# Altium project FluidGuard(Rx).PrjPcb (part 1 of 3)
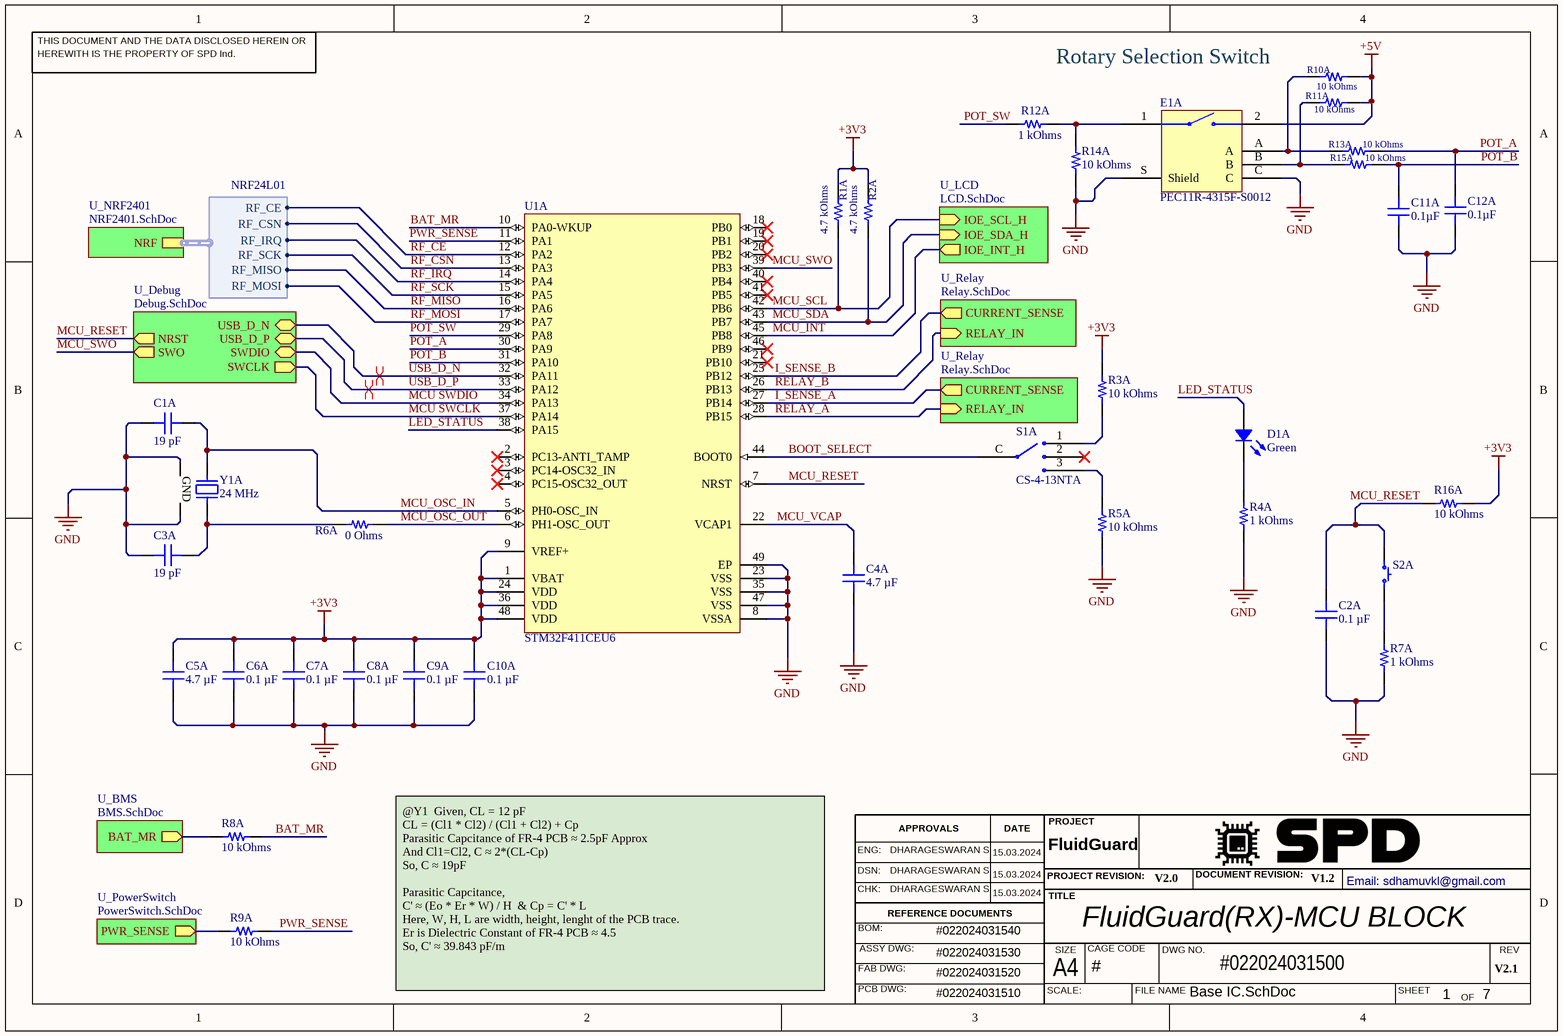
[diagram p0: Base IC.SchDoc]
CAGE_CODE: #; Date: 15.03.2024; DOC_NO_ASSY_DWG: #022024031530; DOC_NO_BOM: #022024031540; DOC_NO_FAB_DWG: #022024031520; DOC_NO_SCH_DWG: #022024031500; DocumentRevision: V1.2; PCB_DWG_NO: #022024031510; Project: FluidGuard; ProjectRevision: V2.0; Revision: V2.1
7 sheets, 151 parts. Net scope: hierarchical (ports join the sheet entries above them; power ports are global).
Board file: FluidGuard(RX).PcbDoc
Sheets:
  Base IC.SchDoc
    U_LCD = LCD.SchDoc
    U_Relay = Relay.SchDoc
    U_Relay = Relay.SchDoc
    U_PowerSwitch = PowerSwitch.SchDoc
    U_Debug = Debug.SchDoc
    U_BMS = BMS.SchDoc
    U_NRF2401 = NRF2401.SchDoc

## Sheet Base IC.SchDoc: FluidGuard(RX)-MCU BLOCK
size A4; SheetNumber: 1; SheetTotal: 7

### Parts
C1A  19 pF  [CAP 0402_1005]
C2A  0.1 µF  [CAP 0402_1005]
C3A  19 pF  [CAP 0402_1005]
C4A  4.7 µF  [CAP 0402_1005]
C5A  4.7 µF  [CAP 0402_1005]
C6A  0.1 µF  [CAP 0402_1005]
C7A  0.1 µF  [CAP 0402_1005]
C8A  0.1 µF  [CAP 0402_1005]
C9A  0.1 µF  [CAP 0402_1005]
C10A  0.1 µF  [CAP 0402_1005]
C11A  0.1µF  [CAP 0402_1005]
C12A  0.1µF  [CAP 0402_1005]
D1A  Green  [LED 0402_1005 GREEN]
E1A  PEC11R-4315F-S0012  [BOURNS PEC11R-4315F-S0012]
R1A  4.7 kOhms  [RES 0402_1005]
R2A  4.7 kOhms  [RES 0402_1005]
R3A  10 kOhms  [RES 0402_1005]
R4A  1 kOhms  [RES 0402_1005]
R5A  10 kOhms  [RES 0402_1005]
R6A  0 Ohms  [RES 0402_1005]
R7A  1 kOhms  [RES 0402_1005]
R8A  10 kOhms  [RES 0402_1005]
R9A  10 kOhms  [RES 0402_1005]
R10A  10 kOhms  [RES 0402_1005]
R11A  10 kOhms  [RES 0402_1005]
R12A  1 kOhms  [RES 0402_1005]
R13A  10 kOhms  [RES 0402_1005]
R14A  10 kOhms  [RES 0402_1005]
R15A  10 kOhms  [RES 0402_1005]
R16A  10 kOhms  [RES 0402_1005]
S1A  CS-4-13NTA  [NIDEC COPAL CS-4-13NTA]
S2A  EVP-AWED4A  [PANASONIC EVPAW]  (value not drawn)
U1A  STM32F411CEU6  [STM-UFQFPN48_L]
Y1A  24 MHz  [EPSON TSX-3225]

### Sub-sheets
U_BMS = BMS.SchDoc: BAT_MR (out)
U_Debug = Debug.SchDoc: USB_D_N (bidir), USB_D_P (bidir), SWDIO (bidir), SWCLK (out), NRST (out), SWO (out)
U_LCD = LCD.SchDoc: IOE_SCL_H (in), IOE_SDA_H (in), IOE_INT_H (out)
U_NRF2401 = NRF2401.SchDoc: NRF (harness NRF24L01)
U_PowerSwitch = PowerSwitch.SchDoc: PWR_SENSE (out)
U_Relay = Relay.SchDoc: CURRENT_SENSE (out), RELAY_IN (in)
U_Relay = Relay.SchDoc: CURRENT_SENSE (out), RELAY_IN (in)

### Harnesses
NRF24L01: RF_CE, RF_CSN, RF_SCK, RF_MISO, RF_MOSI, RF_IRQ

### Nets
+3V3: C5A.2 C6A.2 C7A.2 C8A.2 C9A.2 C10A.2 R1A.2 R2A.2 R3A.2 R16A.1 U1A.1(VBAT) U1A.9(VREF+) U1A.24(VDD) U1A.36(VDD) U1A.48(VDD)
+5V: E1A.2 R10A.2 R11A.2
GND: C1A.1 C2A.1 C3A.1 C4A.1 C5A.1 C6A.1 C7A.1 C8A.1 C9A.1 C10A.1 C11A.1 C12A.1 E1A.C E1A.S(Shield) R4A.1 R5A.1 R7A.1 R14A.1 U1A.8(VSSA) U1A.23(VSS) U1A.35(VSS) U1A.47(VSS) U1A.49(EP) Y1A.2(GND) Y1A.4(GND)
BAT_MR: R8A.1 U1A.10(PA0-WKUP)
BOOT_SELECT: S1A.C U1A.44(BOOT0)
I_SENSE_A: U1A.27(PB14) ; sheet U_Relay/CURRENT_SENSE
I_SENSE_B: U1A.25(PB12) ; sheet U_Relay/CURRENT_SENSE
LED_STATUS: D1A.1 U1A.38(PA15)
MCU SWCLK: U1A.37(PA14) ; sheet U_Debug/SWCLK
MCU SWDIO: U1A.34(PA13) ; sheet U_Debug/SWDIO
MCU_INT: U1A.45(PB8) ; sheet U_LCD/IOE_INT_H
MCU_OSC_IN: C1A.2 U1A.5(PH0-OSC_IN) Y1A.1
MCU_OSC_OUT: R6A.2 U1A.6(PH1-OSC_OUT)
MCU_RESET: C2A.2 R16A.2 S2A.1 U1A.7(NRST) ; sheet U_Debug/NRST
MCU_SCL: R1A.1 U1A.42(PB6) ; sheet U_LCD/IOE_SCL_H
MCU_SDA: R2A.1 U1A.43(PB7) ; sheet U_LCD/IOE_SDA_H
MCU_SWO: U1A.39(PB3) ; sheet U_Debug/SWO  [project net MCU SWO]
MCU_VCAP: C4A.2 U1A.22(VCAP1)
POT_A: C12A.2 R13A.1 U1A.30(PA9)
POT_B: C11A.2 R15A.1 U1A.31(PA10)
POT_SW: R12A.2 U1A.29(PA8)
PWR_SENSE: R9A.1 U1A.11(PA1)
RELAY_A: U1A.28(PB15) ; sheet U_Relay/RELAY_IN
RELAY_B: U1A.26(PB13) ; sheet U_Relay/RELAY_IN
RF_CE: U1A.12(PA2) ; sheet U_NRF2401/NRF.RF_CE
RF_CSN: U1A.13(PA3) ; sheet U_NRF2401/NRF.RF_CSN
RF_IRQ: U1A.14(PA4) ; sheet U_NRF2401/NRF.RF_IRQ
RF_MISO: U1A.16(PA6) ; sheet U_NRF2401/NRF.RF_MISO
RF_MOSI: U1A.17(PA7) ; sheet U_NRF2401/NRF.RF_MOSI
RF_SCK: U1A.15(PA5) ; sheet U_NRF2401/NRF.RF_SCK
USB_D_N: U1A.32(PA11) ; sheet U_Debug/USB_D_N  [project net TVS_D_N]
USB_D_P: U1A.33(PA12) ; sheet U_Debug/USB_D_P  [project net TVS_D_P]
NetC3A_2: C3A.2 R6A.1 Y1A.3
NetD1A_2: D1A.2 R4A.2
NetE1A_1: E1A.1 R12A.1 R14A.2
NetE1A_A: E1A.A R10A.1 R13A.2
NetE1A_B: E1A.B R11A.1 R15A.2
NetIC1E_4: R9A.2 ; sheet U_PowerSwitch/PWR_SENSE
NetR3A_1: R3A.1 S1A.1
NetR5A_2: R5A.2 S1A.3
NetR6D_1: R8A.2 ; sheet U_BMS/BAT_MR
NetR7A_2: R7A.2 S2A.2

Not connected (* = marked no-connect by the designer): S1A 2*; U1A 2(PC13-ANTI_TAMP)* 3(PC14-OSC32_IN)* 4(PC15-OSC32_OUT)* 18(PB0)* 19(PB1)* 20(PB2)* 21(PB10)* 40(PB4)* 41(PB5)* 46(PB9)*

### Layout directives
differential pair: TVS_D_N, TVS_D_P

### Notes on the sheet
- (near R10A) Rotary Selection Switch
- @Y1  Given, CL = 12 pF
  CL = (Cl1 * Cl2) / (Cl1 + Cl2) + Cp
  Parasitic Capcitance of FR-4 PCB ≈ 2.5pF Approx
  And Cl1=Cl2, C ≈ 2*(CL-Cp)
  So, C ≈ 19pF
  Parasitic Capcitance,
  C' ≈ (Eo * Er * W) / H  & Cp = C' * L
  Here, W, H, L are width, height, lenght of the PCB trace.
  Er is Dielectric Constant of FR-4 PCB ≈ 4.5
  So, C' ≈ 39.843 pF/m
- THIS DOCUMENT AND THE DATA DISCLOSED HEREIN OR
- HEREWITH IS THE PROPERTY OF SPD Ind.
- ENG:
- DHARAGESWARAN S
- APPROVALS
- DATE
- PROJECT
- DSN:
- CHK:
- REFERENCE DOCUMENTS
- PROJECT REVISION:
- TITLE
- DOCUMENT REVISION:
- Email: sdhamuvkl@gmail.com <https://github.com/DhamuVkl>
- BOM:
- FAB DWG:
- PCB DWG:
- ASSY DWG:
- SCALE:
- A4
- SIZE
- CAGE CODE
- FILE NAME
- DWG NO.
- SHEET
- REV
- OF

### Library data of the parts
C1A C3A = GJM1555C1H190GB01D: CAP CER 19PF 50VDC 0402 C0G 2%; Manufacturer: Murata Electronics; id: 5279; Temperature Coefficient: C0G, NP0; Voltage - Rated: 50V; Part Number: GJM1555C1H190GB01D; Value: 19 pF; Supplier Part Number 1: 490-GJM1555C1H190GB01DCT-ND; ComponentLink2Description: DigiKey Link; Features: High Q, Low Loss; ComponentLink1URL: https://search.murata.co.jp/Ceramy/image/img/A01X/G101/ENG/GJM1555C1H190GB01-01A.pdf; PartId: 41775; Tolerance: ±2%; Supplier 1: DigiKey; Series: GJM; LastUpdated: 2023-01-03T20:03:22.137; Part Status: Active; Capacitance: 19 pF; Device Package: 0402 (1005 Metric); Thickness (Max): 0.022" (0.55mm); Minimum Order: 1; Packaging: TapeAndReel; Applications: RF, Microwave, High Frequency; Package / Case: 0402 (1005 Metric); ComponentLink1Description: Datasheet; Price: 0.02; ComponentLink2URL: https://www.digikey.com/en/products/detail/murata-electronics/GJM1555C1H190GB01D/16033843; Lifecycle Status: Active; Operating Temperature: -55°C ~ 125°C; Size / Dimension: 0.039" L x 0.020" W (1.00mm x 0.50mm); Mounting Type: Surface Mount, MLCC
C2A C6A C7A C8A C9A C10A = CL05B104KP5VPNC: CAP CER 100NF 10V X7R 0402; Manufacturer: Samsung Electro-Mechanics; id: 7736; Tolerance: ±10%; Part Number: CL05B104KP5VPNC; Value: 0.1 µF; Temperature Coefficient: X7R; Supplier Part Number 1: 1276-CL05B104KP5VPNCCT-ND; ComponentLink2Description: DigiKey Link; ComponentLink1URL: https://mm.digikey.com/Volume0/opasdata/d220001/medias/docus/5458/CL05B104KP5VPNC_Spec.pdf; PartId: 56690; Supplier 1: DigiKey; Series: CL; LastUpdated: 2023-11-05T20:02:55.743; Capacitance: 0.1 µF; Device Package: 0402 (1005 Metric); Ratings: AEC-Q200; Thickness (Max): 0.022" (0.55mm); Voltage - Rated: 10V; Minimum Order: 1; Packaging: TapeAndReel; Applications: Automotive; Package / Case: 0402 (1005 Metric); ComponentLink1Description: Datasheet; Price: 0.01; ComponentLink2URL: https://www.digikey.com/en/products/detail/samsung-electro-mechanics/CL05B104KP5VPNC/20498482; Lifecycle Status: Active; Operating Temperature: -55°C ~ 125°C; Size / Dimension: 0.039" L x 0.020" W (1.00mm x 0.50mm); Mounting Type: Surface Mount, MLCC
C4A C5A = GMC04X5R475K10NT: CAP0402 X5R 4.7UF 10% 10V; Manufacturer: Cal-Chip Electronics, Inc.; id: 6422; Part Number: GMC04X5R475K10NT; Value: 4.7 µF; Temperature Coefficient: X5R; Supplier Part Number 1: 4713-GMC04X5R475K10NTCT-ND; ComponentLink2Description: DigiKey Link; ComponentLink1URL: https://88ce57.p3cdn1.secureserver.net/wp-content/uploads/2023/01/gmc_series-2.pdf; PartId: 49814; Tolerance: ±10%; Supplier 1: DigiKey; Series: GMC; LastUpdated: 2023-04-21T19:03:30.743; Part Status: Active; Capacitance: 4.7 µF; Device Package: 0402 (1005 Metric); Thickness (Max): 0.028" (0.70mm); Voltage - Rated: 10V; Minimum Order: 1; Packaging: TapeAndReel; Applications: General Purpose; Package / Case: 0402 (1005 Metric); ComponentLink1Description: Datasheet; Price: 0.01; ComponentLink2URL: https://www.digikey.com/en/products/detail/cal-chip-electronics-inc/GMC04X5R475K10NT/18151135; Lifecycle Status: Active; Operating Temperature: -55°C ~ 85°C; Size / Dimension: 0.039" L x 0.020" W (1.00mm x 0.50mm); Mounting Type: Surface Mount, MLCC
C11A C12A = LD02ZD104KAB2A: CAP CER 0.1UF 10V X5R 0402; Manufacturer: AVX Corporation; id: 74; Tolerance: ±10%; Part Number: LD02ZD104KAB2A; Value: 0.1µF; Temperature Coefficient: X5R; Supplier Part Number 1: 478-4926-1-ND; ComponentLink2Description: DigiKey Link; ComponentLink1URL: http://datasheets.avx.com/LD-Series.pdf; PartId: 1811; Supplier 1: DigiKey; Series: LD; LastUpdated: 2022-02-08T12:26:58.257; Part Status: Active; Capacitance: 0.1µF; Device Package: 0402 (1005 Metric); Thickness (Max): 0.022" (0.56mm); Voltage - Rated: 10V; Minimum Order: 1; Packaging: TapeAndReel; Applications: General Purpose; Package / Case: 0402 (1005 Metric); ComponentLink1Description: Datasheet; Price: 0.20; ComponentLink2URL: http://digikey.com/product-detail/en/avx-corporation/LD02ZD104KAB2A/478-4926-1-ND/1858872; Lifecycle Status: Active; Operating Temperature: -55°C ~ 85°C; Size / Dimension: 0.039" L x 0.020" W (1.00mm x 0.50mm); Mounting Type: Surface Mount, MLCC
D1A = HSMG-C280: LED GREEN DIFFUSED 0402 SMD; Manufacturer: Broadcom Limited; id: 697; Lens Color: White; Wavelength - Peak: 570nm; Lens Style: Rectangle with Flat Top; Viewing Angle: 130°; Lens Size: 1.00mm x 0.50mm; Configuration: Standard; Wavelength - Dominant: 572nm; Voltage - Forward (Vf) (Typ): 2.2V; Current - Test: 20mA; Millicandela Rating: 15mcd; Part Number: HSMG-C280; Supplier Part Number 1: 516-3066-1-ND; Lens Transparency: Diffused; Supplier Device Package: 0402; ComponentLink1Description: Datasheet; Color: Green; ComponentLink2URL: https://www.digikey.com/en/products/detail/broadcom-limited/HSMG-C280/1235358; ComponentLink1URL: https://docs.broadcom.com/docs/AV02-0602EN; Supplier 1: DigiKey; Series: -; Height (Max): 0.40mm; Part Status: Active; ComponentLink2Description: DigiKey Link; Device Package: 0402 (1005 Metric); Packaging: TapeAndReel; Minimum Order: 1; Package / Case: 0402 (1005 Metric); PartId: 697; Lifecycle Status: Active; LastUpdated: 2023-01-02T20:56:26.750; Value: Green; Size / Dimension: 1.00mm L x 0.50mm W; Mounting Type: Surface Mount; Price: 0.08
E1A = PEC11R-4315F-S0012: ROTARY ENCODER MECHANICAL 12PPR; Manufacturer 1: Bourns; Manufacturer: Bourns Inc.; Output Type: Quadrature (Incremental); Built in Switch: Yes; Number of Channels: 2; Pulses per Revolution: 12; Capacitance: 4315F; id: 3; Actuator Type: 6mm Dia Flatted End; Rotational Life (Cycles Min): 30K; Supplier 1: DigiKey; Manufacturer Part Number 1: PEC11R-4315F-S0012; Stock 1: 453; Pricing 1: 1=1.91000, 10=1.68200, 25=1.50800, 50=1.45000, 100=1.39200, 250=1.33400, 500=1.10200, 1000=1.04400, 5000=0.87000 (USD); RoHS: Yes; Mount: Through Hole,Panel,PCB; Min Operating Temperature: -30°C; Max Operating Temperature: 70°C; Termination: PC Pin; Packaging: Unknown; Package Quantity: 75; Encoder Type: Mechanical; Detent: Yes; Orientation: Vertical; Length: 21.5mm; Height: 13.4mm; Width: 12.5mm; ComponentLink1URL: https://www.bourns.com/docs/Product-Datasheets/PEC11R.pdf; ComponentLink1Description: Datasheet; ComponentLink2URL: http://digikey.com/product-detail/en/bourns-inc/PEC11R-4315F-S0012/PEC11R-4315F-S0012-ND/4699232; ComponentLink2Description: DigiKey Link; Part Number: PEC11R-4315F-S0012; Supplier Part Number 1: PEC11R-4315F-S0012-ND; Series: PEC11R; Part Status: Active; Minimum Order: 1; Lifecycle Status: Active; LastUpdated: 2020-06-25T15:43:11.617; Termination Style: PC Pin; Mounting Type: Panel, PCB Through Hole; Price: 1.91
R1A R2A = AC0402FR-074K7L: RES SMD 4.7K OHM 1% 1/16W 0402; Manufacturer: Yageo; id: 4996; Temperature Coefficient: ±100ppm/°C; Power (Watts): 0.063W, 1/16W; Part Number: AC0402FR-074K7L; Height - Seated (Max): 0.015" (0.37mm); Supplier Part Number 1: YAG3497CT-ND; Supplier Device Package: 0402; ComponentLink1Description: Datasheet; ComponentLink2URL: https://www.digikey.com/en/products/detail/yageo/AC0402FR-074K7L/5895396; Features: Automotive AEC-Q200, Moisture Resistant; ComponentLink1URL: https://www.yageo.com/upload/media/product/productsearch/datasheet/rchip/PYu-AC_51_RoHS_L_7.pdf; Composition: Thick Film; Tolerance: ±1%; Supplier 1: DigiKey; Series: AC; Part Status: Active; ComponentLink2Description: DigiKey Link; Device Package: 0402 (1005 Metric); Packaging: CutTape; Ratings: AEC-Q200; Minimum Order: 1; Package / Case: 0402 (1005 Metric); PartId: 12051; Lifecycle Status: Active; LastUpdated: 2023-01-02T20:21:09.847; Operating Temperature: -55°C ~ 155°C; Number Of Terminations: 2; Value: 4.7 kOhms; Size / Dimension: 0.039" L x 0.020" W (1.00mm x 0.50mm); Price: 0.01; Resistance: 4.7 kOhms
R3A R5A R8A R9A R10A R11A R13A R14A R15A R16A = AA0402FR-0710KL: RES SMD 10K OHM 1% 1/16W 0402; Manufacturer: Yageo; id: 10610; Temperature Coefficient: ±150ppm/°C; Power (Watts): 0.063W, 1/16W; Part Number: AA0402FR-0710KL; Height - Seated (Max): 0.015" (0.37mm); Supplier Part Number 1: 13-AA0402FR-0710KLCT-ND; Supplier Device Package: 0402; ComponentLink1Description: Datasheet; ComponentLink2URL: https://www.digikey.com/en/products/detail/yageo/AA0402FR-0710KL/5887729; Features: Anti-Sulfur, Automotive AEC-Q200, Moisture Resistant; ComponentLink1URL: https://www.yageo.com/upload/media/product/productsearch/datasheet/rchip/PYu-AA_51_RoHS_L_3.pdf; Composition: Thick Film; Tolerance: ±1%; Supplier 1: DigiKey; Series: AA; Part Status: Active; ComponentLink2Description: DigiKey Link; Device Package: 0402 (1005 Metric); Packaging: TapeAndReel; Ratings: AEC-Q200; Minimum Order: 1; Package / Case: 0402 (1005 Metric); PartId: 59190; Lifecycle Status: Active; LastUpdated: 2023-01-02T20:20:10.303; Operating Temperature: -55°C ~ 155°C; Number Of Terminations: 2; Value: 10 kOhms; Size / Dimension: 0.039" L x 0.020" W (1.00mm x 0.50mm); Price: 0.01; Resistance: 10 kOhms
R4A R7A R12A = AA0402FR-071KL: RES SMD 1K OHM 1% 1/16W 0402; Manufacturer: Yageo; id: 10598; Temperature Coefficient: ±150ppm/°C; Power (Watts): 0.063W, 1/16W; Part Number: AA0402FR-071KL; Height - Seated (Max): 0.015" (0.37mm); Supplier Part Number 1: 13-AA0402FR-071KLCT-ND; Supplier Device Package: 0402; ComponentLink1Description: Datasheet; ComponentLink2URL: https://www.digikey.com/en/products/detail/yageo/AA0402FR-071KL/5887878; Features: Anti-Sulfur, Automotive AEC-Q200, Moisture Resistant; ComponentLink1URL: https://www.yageo.com/upload/media/product/productsearch/datasheet/rchip/PYu-AA_51_RoHS_L_3.pdf; Composition: Thick Film; Tolerance: ±1%; Supplier 1: DigiKey; Series: AA; Part Status: Active; ComponentLink2Description: DigiKey Link; Device Package: 0402 (1005 Metric); Packaging: TapeAndReel; Ratings: AEC-Q200; Minimum Order: 1; Package / Case: 0402 (1005 Metric); PartId: 59178; Lifecycle Status: Active; LastUpdated: 2023-01-02T20:20:10.210; Operating Temperature: -55°C ~ 155°C; Number Of Terminations: 2; Value: 1 kOhms; Size / Dimension: 0.039" L x 0.020" W (1.00mm x 0.50mm); Price: 0.01; Resistance: 1 kOhms
R6A = AC0402JR-070RL: RES SMD 0 OHM JUMPER 1/16W 0402; Manufacturer: Yageo; id: 9339; Power (Watts): 0.063W, 1/16W; Part Number: AC0402JR-070RL; Height - Seated (Max): 0.015" (0.37mm); Supplier Part Number 1: 311-0.0LBCT-ND; Supplier Device Package: 0402; ComponentLink1Description: Datasheet; ComponentLink2URL: https://www.digikey.com/en/products/detail/yageo/AC0402JR-070RL/2827807; Features: Automotive AEC-Q200, Moisture Resistant; ComponentLink1URL: https://www.yageo.com/upload/media/product/productsearch/datasheet/rchip/PYu-AC_51_RoHS_L_7.pdf; Composition: Thick Film; Tolerance: Jumper; Supplier 1: DigiKey; Series: AC; Part Status: Active; ComponentLink2Description: DigiKey Link; Device Package: 0402 (1005 Metric); Packaging: CutTape; Ratings: AEC-Q200; Minimum Order: 1; Package / Case: 0402 (1005 Metric); PartId: 20617; Lifecycle Status: Active; LastUpdated: 2023-01-02T20:20:32.243; Operating Temperature: -55°C ~ 155°C; Number Of Terminations: 2; Value: 0 Ohms; Size / Dimension: 0.039" L x 0.020" W (1.00mm x 0.50mm); Price: 0.01; Resistance: 0 Ohms
S1A = CS-4-13NTA: SWITCH ROTARY DIP SP3T 100MA 16V; Manufacturer: Nidec Copal Electronics; id: 6; Actuator Level: Flush, Recessed; Number Of Positions: 3; Washable: Yes; Pitch: 0.051" (1.30mm); Actuator Type: Rotary for Tool; Part Number: CS-4-13NTA; Height Above Board: 0.091" (2.30mm); Supplier Part Number 1: 563-1035-1-ND; Current Rating (Amps): 100mA; ComponentLink1Description: Datasheet; Contact Material: Copper Alloy; ComponentLink2URL: https://www.digikey.com/en/products/detail/nidec-copal-electronics/CS-4-13NTA/948346; ComponentLink1URL: https://www.nidec-copal-electronics.com/e/catalog/switch/cs-4.pdf; Supplier 1: DigiKey; Series: CS-4; Part Status: Active; ComponentLink2Description: DigiKey Link; Packaging: TapeAndReel; Minimum Order: 1; Contact Finish: Gold; PartId: 13; Lifecycle Status: Active; LastUpdated: 2022-09-26T03:19:43.077; Termination Style: J Lead; Operating Temperature: -25°C ~ 70°C; Circuit: SP3T; Mounting Type: Surface Mount; Price: 0.93
S2A = EVP-AWED4A: 3.0MM X 2.0MM / 3.3N / 0.15MM ST; Manufacturer: Panasonic Electronic Components; id: 5; Switch Function: Off-Mom; Contact Rating @ Voltage: 0.02A @ 15VDC; Outline: 3.00mm x 2.00mm; Actuator Height Off Pcb, Vertical: 0.60mm; Ingress Protection: IP67 - Dust Tight, Waterproof; Actuator Orientation: Top Actuated; Actuator Type: Standard; Illumination: Non-Illuminated; Operating Force: 330gf; Circuit: SPST-NO; Part Number: EVP-AWED4A; Supplier Part Number 1: P123440CT-ND; ComponentLink1Description: Datasheet; ComponentLink2URL: https://www.digikey.com/en/products/detail/panasonic-electronic-components/EVP-AWED4A/8568275; ComponentLink1URL: https://industrial.panasonic.com/ac/cdn/e/control/switch/light-touch/catalog/sw_lt_eng_3020s.pdf; Supplier 1: DigiKey; Series: EVPAW; Part Status: Active; ComponentLink2Description: DigiKey Link; Packaging: TapeAndReel; Minimum Order: 1; Lifecycle Status: Active; LastUpdated: 2023-01-02T21:07:29.980; Termination Style: SMD (SMT) Tab; Operating Temperature: -40°C ~ 85°C; Mounting Type: Surface Mount; Price: 0.16
U1A = CMP-0243-00165-1: ARM Cortex-M4 32-bit MCU+FPU, 512 KB Flash, 128 KB RAM, 36 I/Os, 48-Pin UFQFPN, -40 to 85 degC, Tray; Operating Frequency(F) (Processor speed) (MHz): 100; FLASH Size (Prog) (kB): 512; Internal RAM Size (kB): 128; I/Os (High Current): 36; Supply Voltage(Vcc) min (V): 1.7; Package Reference: 48-Pin Ultra Thin Fine Pitch Quad Flat No-Lead, 7 x 7 x 0.6 mm Body, 0.5 mm Pitch, Exposed Pad; ComponentLink1Description: Manufacturer URL; ComponentLink1URL: http://www.st.com/; Packing: Tray; Package Description: UFQFPN48; Core: ARM Cortex-M4; ComponentLink2Description: Datasheet; ComponentLink2URL: http://www.st.com/st-web-ui/static/active/en/resource/technical/document/datasheet/DM00115249.pdf; DatasheetVersion: Rev. 6; Mounting Technology: Surface Mount
Y1A = TSX-3225 24.0000MF15X-AC3: CRYSTAL 24.0000MHZ 9PF SMD; Manufacturer: EPSON; id: 441; Frequency Tolerance: ±10ppm; Frequency Stability: ±15ppm; Operating Mode: Fundamental; Esr (Equivalent Series Resistance): 40 Ohms; Part Number: TSX-3225 24.0000MF15X-AC3; Height - Seated (Max): 0.024" (0.60mm); Supplier Part Number 1: SER3635CT-ND; ComponentLink1Description: Datasheet; ComponentLink2URL: https://www.digikey.com/en/products/detail/epson/TSX-3225-24-0000MF15X-AC3/1825444; ComponentLink1URL: https://support.epson.biz/td/api/doc_check.php?dl=brief_TSX-3225&lang=en; Supplier 1: DigiKey; Frequency: 24 MHz; Series: TSX-3225; Part Status: Active; Type: MHz Crystal; ComponentLink2Description: DigiKey Link; Packaging: TapeAndReel; Minimum Order: 1; Package / Case: 4-SMD, No Lead; PartId: 441; Lifecycle Status: Active; LastUpdated: 2023-01-02T20:58:19.840; Operating Temperature: -40°C ~ 85°C; Value: 24 MHz; Size / Dimension: 0.126" L x 0.098" W (3.20mm x 2.50mm); Mounting Type: Surface Mount; Price: 0.44; Load Capacitance: 9pF

## Sheet LCD.SchDoc: LCD I2C BLOCK
size A4; SheetNumber: 3; SheetTotal: 7; DOC_NO_SCH_DWG: #022024031502
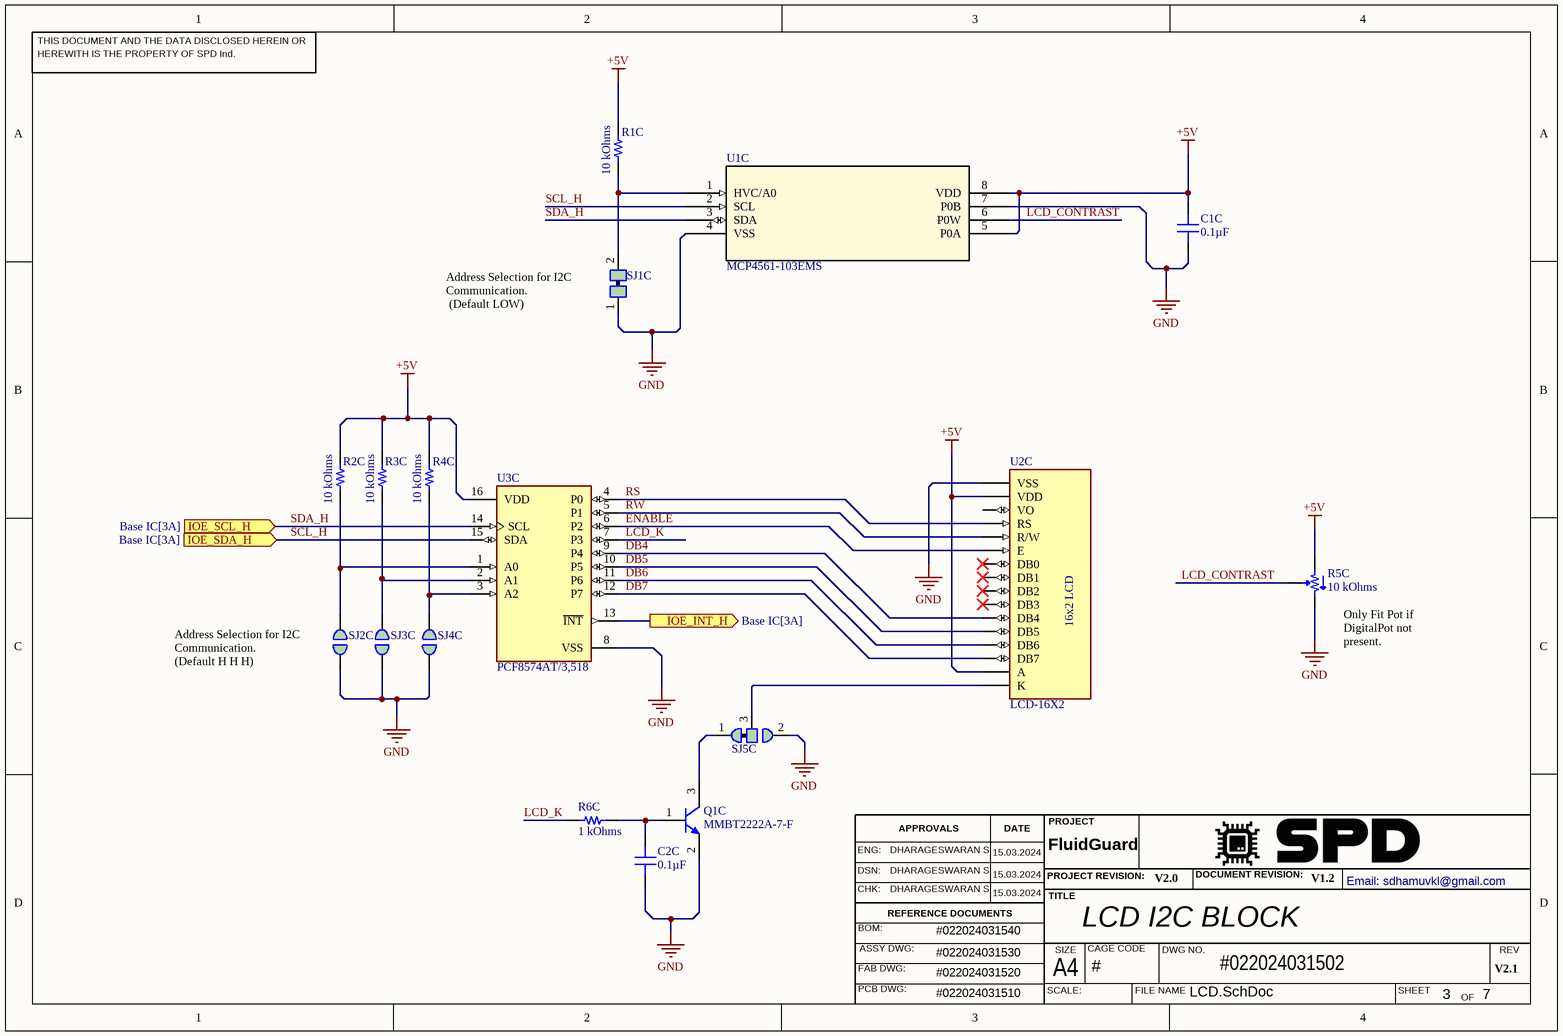
[diagram p1: LCD.SchDoc]

### Parts
C1C  0.1µF  [CAP 0402_1005]
C2C  0.1µF  [CAP 0402_1005]
Q1C  MMBT2222A-7-F  [DIODES SOT-23-3]
R1C  10 kOhms  [RES 0402_1005]
R2C  10 kOhms  [RES 0402_1005]
R3C  10 kOhms  [RES 0402_1005]
R4C  10 kOhms  [RES 0402_1005]
R5C  10 kOhms  [BOURNS TRIMPOT 3299P]
R6C  1 kOhms  [RES 0402_1005]
SJ1C  2PIN  [Rectangular Jumper Joint]  (value not drawn)
SJ2C  2PIN  [Rounded Jumper]  (value not drawn)
SJ3C  2PIN  [Rounded Jumper]  (value not drawn)
SJ4C  2PIN  [Rounded Jumper]  (value not drawn)
SJ5C  3PIN  [Rounded Jumper Joint 3-pin]  (value not drawn)
U1C  MCP4561-103EMS  [MSOP8_MC_MCH]
U2C  LCD-16X2  [LCD-16X2 Pin]
U3C  PCF8574AT/3,518  [FP-SOT162-1-MFG]

### Ports
IOE_INT_H (out, see Base IC[3A]), IOE_SCL_H (in, see Base IC[3A]), IOE_SDA_H (in, see Base IC[3A])

### Nets
+5V: C1C.2 R1C.2 R2C.2 R3C.2 R4C.2 R5C.1 U1C.5(P0A) U1C.8(VDD) U2C.2(VDD) U2C.15(A) U3C.16(VDD)
GND: C1C.1 C2C.1 Q1C.2(E) R5C.3 SJ1C.1 SJ2C.1 SJ3C.1 SJ4C.1 SJ5C.2 U1C.4(VSS) U1C.7(P0B) U2C.1(VSS) U3C.8(VSS)
DB4: U2C.11(DB4) U3C.9(P4)
DB5: U2C.12(DB5) U3C.10(P5)
DB6: U2C.13(DB6) U3C.11(P6)
DB7: U2C.14(DB7) U3C.12(P7)
ENABLE: U2C.6(E) U3C.6(P2)
LCD_CONTRAST: R5C.2 U1C.6(P0W)
LCD_K: R6C.1 U3C.7(P3)
MCU_INT: U3C.13(~{INT}) ; port IOE_INT_H
RS: U2C.4(RS) U3C.4(P0)
RW: U2C.5(R/W) U3C.5(P1)
SCL_H: U1C.2(SCL) U3C.15(SDA) ; port IOE_SDA_H  [project net MCU_SDA]
SDA_H: U1C.3(SDA) U3C.14(SCL) ; port IOE_SCL_H  [project net MCU_SCL]
NetC2C_2: C2C.2 Q1C.1(B) R6C.2
NetQ1C_3: Q1C.3(C) SJ5C.1
NetR1C_1: R1C.1 SJ1C.2 U1C.1(HVC/A0)
NetR2C_1: R2C.1 SJ2C.2 U3C.1(A0)
NetR3C_1: R3C.1 SJ3C.2 U3C.2(A1)
NetR4C_1: R4C.1 SJ4C.2 U3C.3(A2)
NetSJ5C_3: SJ5C.3 U2C.16(K)

Not connected (* = marked no-connect by the designer): U2C 3(VO) 7(DB0)* 8(DB1)* 9(DB2)* 10(DB3)*

### Notes on the sheet
- (near SJ1C) Address Selection for I2C Communication.
  (Default LOW)
- (near SJ2C) Address Selection for I2C Communication.
  (Default H H H)
- (near R5C) Only Fit Pot if DigitalPot not present.
- THIS DOCUMENT AND THE DATA DISCLOSED HEREIN OR
- HEREWITH IS THE PROPERTY OF SPD Ind.
- ENG:
- DHARAGESWARAN S
- APPROVALS
- DATE
- PROJECT
- DSN:
- CHK:
- REFERENCE DOCUMENTS
- PROJECT REVISION:
- TITLE
- DOCUMENT REVISION:
- Email: sdhamuvkl@gmail.com <https://github.com/DhamuVkl>
- BOM:
- FAB DWG:
- PCB DWG:
- ASSY DWG:
- SCALE:
- A4
- SIZE
- CAGE CODE
- FILE NAME
- DWG NO.
- SHEET
- REV
- OF
- (in symbol LCD-16X2) 16x2 LCD

### Library data of the parts
C1C C2C = 0402YC104KAT2A: CAP CER 0.1UF 16V X7R 0402; Manufacturer: AVX Corporation; id: 643; Tolerance: ±10%; Part Number: 0402YC104KAT2A; Value: 0.1µF; Temperature Coefficient: X7R; Supplier Part Number 1: 478-7888-1-ND; ComponentLink2Description: DigiKey Link; ComponentLink1URL: http://datasheets.avx.com/X7RDielectric.pdf; PartId: 3104; Supplier 1: DigiKey; Series: -; LastUpdated: 2022-02-08T12:26:55.697; Part Status: Active; Capacitance: 0.1µF; Device Package: 0402 (1005 Metric); Thickness (Max): 0.022" (0.55mm); Voltage - Rated: 16V; Minimum Order: 1; Packaging: TapeAndReel; Applications: General Purpose; Package / Case: 0402 (1005 Metric); ComponentLink1Description: Datasheet; Price: 0.01; ComponentLink2URL: http://digikey.com/product-detail/en/avx-corporation/0402YC104KAT2A/478-7888-1-ND/3881511; Lifecycle Status: Active; Operating Temperature: -55°C ~ 125°C; Size / Dimension: 0.039" L x 0.020" W (1.00mm x 0.50mm); Mounting Type: Surface Mount, MLCC
Q1C = MMBT2222A-7-F: TRANS NPN 40V 0.6A SOT23-3; Manufacturer: Diodes Incorporated; id: 84; Current - Collector (Ic) (Max): 600 mA; Power - Max: 310 mW; DC Current Gain (Hfe) (Min) @ Ic, Vce: 100 @ 150mA, 10V; Current - Collector Cutoff (Max): 10nA (ICBO); Vce Saturation (Max) @ Ib, Ic: 1V @ 50mA, 500mA; Frequency - Transition: 300MHz; Part Number: MMBT2222A-7-F; Supplier Part Number 1: MMBT2222A-FDICT-ND; Supplier Device Package: SOT-23-3; ComponentLink1Description: Datasheet; ComponentLink2URL: https://www.digikey.com/en/products/detail/diodes-incorporated/MMBT2222A-7-F/814503; ComponentLink1URL: https://www.diodes.com/assets/Datasheets/ds30041.pdf; Supplier 1: DigiKey; Series: Automotive, AEC-Q101; Part Status: Active; ComponentLink2Description: DigiKey Link; Packaging: TapeAndReel; Minimum Order: 1; Transistor Type: NPN; Voltage - Collector Emitter Breakdown (Max): 40 V; Package / Case: TO-236-3, SC-59, SOT-23-3; PartId: 84; Lifecycle Status: Active; LastUpdated: 2023-01-02T21:11:05.533; Operating Temperature: -55°C ~ 150°C (TJ); Mounting Type: Surface Mount; Price: 0.02
R1C R2C R3C R4C = AC0402FR-1310KL: RES 10K OHM 1% 1/16W 0402; Manufacturer: Yageo; id: 13132; Temperature Coefficient: ±100ppm/°C; Power (Watts): 0.063W, 1/16W; Part Number: AC0402FR-1310KL; Height - Seated (Max): 0.015" (0.37mm); Supplier Part Number 1: 13-AC0402FR-1310KLCT-ND; Supplier Device Package: 0402; ComponentLink1Description: Datasheet; ComponentLink2URL: https://www.digikey.com/en/products/detail/yageo/AC0402FR-1310KL/12756397; Features: Automotive AEC-Q200, Moisture Resistant; ComponentLink1URL: https://www.yageo.com/upload/media/product/productsearch/datasheet/rchip/PYu-AC_51_RoHS_L_8.pdf; Composition: Thick Film; Tolerance: ±1%; Supplier 1: DigiKey; Series: AC; Part Status: Active; ComponentLink2Description: DigiKey Link; Device Package: 0402 (1005 Metric); Packaging: CutTape; Ratings: AEC-Q200; Minimum Order: 1; Package / Case: 0402 (1005 Metric); PartId: 69220; Lifecycle Status: Active; LastUpdated: 2023-01-02T20:19:54.633; Operating Temperature: -55°C ~ 155°C; Number Of Terminations: 2; Value: 10 kOhms; Size / Dimension: 0.039" L x 0.020" W (1.00mm x 0.50mm); Price: 0.01; Resistance: 10 kOhms
R5C = 3299P-1-103LF: TRIMMER 10K OHM 0.5W PC PIN SIDE; Manufacturer: Bourns Inc.; id: 276; Temperature Coefficient: ±100ppm/°C; Resistive Material: Cermet; Tolerance: ±10%; Number Of Turns: 25; Adjustment Type: Side Adjustment; Power (Watts): 0.5W, 1/2W; Part Number: 3299P-1-103LF; Supplier Part Number 1: 3299P-103LF-ND; ComponentLink1Description: Datasheet; ComponentLink2URL: https://www.digikey.com/en/products/detail/bourns-inc/3299P-1-103LF/1088121; ComponentLink1URL: https://www.bourns.com/docs/Product-Datasheets/3299.pdf; Supplier 1: DigiKey; Series: Trimpot® 3299 - Sealed; Part Status: Active; ComponentLink2Description: DigiKey Link; Packaging: Tube; Minimum Order: 1; PartId: 276; Lifecycle Status: Active; LastUpdated: 2023-01-02T21:13:50.730; Termination Style: PC Pins; Value: 10 kOhms; Size / Dimension: Rectangular - 0.240" x 0.375" Face (6.10mm x 9.53mm); Mounting Type: Through Hole; Price: 1.61; Resistance: 10 kOhms
R6C = AC0402DR-071KL: RES 1K OHM 0.5% 1/16W 0402; Manufacturer: Yageo; id: 14909; Temperature Coefficient: ±100ppm/°C; Power (Watts): 0.063W, 1/16W; Part Number: AC0402DR-071KL; Height - Seated (Max): 0.015" (0.37mm); Supplier Part Number 1: 13-AC0402DR-071KLCT-ND; Supplier Device Package: 0402; ComponentLink1Description: Datasheet; ComponentLink2URL: https://www.digikey.com/en/products/detail/yageo/AC0402DR-071KL/16990461; Features: Automotive AEC-Q200, Moisture Resistant; ComponentLink1URL: https://www.yageo.com/upload/media/product/productsearch/datasheet/rchip/PYu-AC_51_RoHS_L_9.pdf; Composition: Thick Film; Tolerance: ±0.5%; Supplier 1: DigiKey; Series: AC; ComponentLink2Description: DigiKey Link; Device Package: 0402 (1005 Metric); Packaging: TapeAndReel; Ratings: AEC-Q200; Minimum Order: 1; Package / Case: 0402 (1005 Metric); PartId: 81039; Lifecycle Status: Active; LastUpdated: 2023-09-02T19:18:23.727; Operating Temperature: -55°C ~ 155°C; Number Of Terminations: 2; Value: 1 kOhms; Size / Dimension: 0.039" L x 0.020" W (1.00mm x 0.50mm); Price: 0.01; Resistance: 1 kOhms
SJ1C = Regtangular Jumper Joint
SJ2C SJ3C SJ4C = Rounded Jumper
SJ5C = Rounded Jumper Joint 3-pin
U1C = MCP4561-103EMS: No Description Available; Mfr_Name: Microchip; RefDes: RefDes; Type: Type; Supplier 1: Mouser; Supplier Part Number 1: 579-MCP4561-103E/MS
U2C = LCD-16X2: Display Development Tools 16x2 Black on Green Char LCD w Backlight; MF: Gravitech; Package: None; Price: None; Value: *; SnapEDA_Link: https://www.snapeda.com/parts/LCD-16X2/Gravitech/view-part/?ref=snap; MP: LCD-16X2; Availability: Not in stock; Check_prices: https://www.snapeda.com/parts/LCD-16X2/Gravitech/view-part/?ref=eda
U3C = CMP-10112-000003-1: IC I/O EXPANDER I2C 8B 16SOIC; Manufacturer: NXP Semiconductors; Interface: I2C,SMBus; Frequency: 100kHz; Nominal Supply Current: 40uA; Max Supply Voltage: 6V; Number Of I/Os: 8; Max Junction Temp: +125°C; Min Supply Voltage: 2.5V; Standoff Height: 0.1mm; RoHS: TRUE; Category: IC; Temperature: -40°C to +85°C; Device Class L3: I/O Expanders; ComponentLink2Description: Datasheet; ComponentLink2URL: https://www.nxp.com/docs/en/data-sheet/PCF8574_PCF8574A.pdf; Digikey Description: IC I/O EXPANDER I2C 8B 16SOIC; Ipc Land Pattern Name: SOIC127P1032X265-16; Mouser Description: PCF8574 Series 2.5 to 6V Remote 8-bit I/O Expander for I2C-bus -SOIC-16; Footprint Url: https://www.nxp.com/docs/en/package-information/SOT162-1.pdf; Lead Free: Yes; Device Class L2: Interface ICs; Ambient Temperature Range Low: -40°C; Temperature Range High: +85°C; Automotive: No; Manufacturer Part Number: PCF8574AT/3,518; Ambient Temperature Range High: +85°C; Height: 2.65mm; Package: SOT162-1; Temperature Range Low: -40°C; Octopart: https://octopart.com/pcf8574at%2F3%2C518-nxp+semiconductors-11541925; Device Class L1: Integrated Circuits (ICs)

## Sheet Relay.SchDoc: LOAD SWITCH & SENSE
size A4; SheetNumber: 6; SheetTotal: 7; DOC_NO_SCH_DWG: #022024031505
Used 2 times, as channels U_Relay, U_Relay. Parts and nets are listed once, with the designators drawn on the sheet.
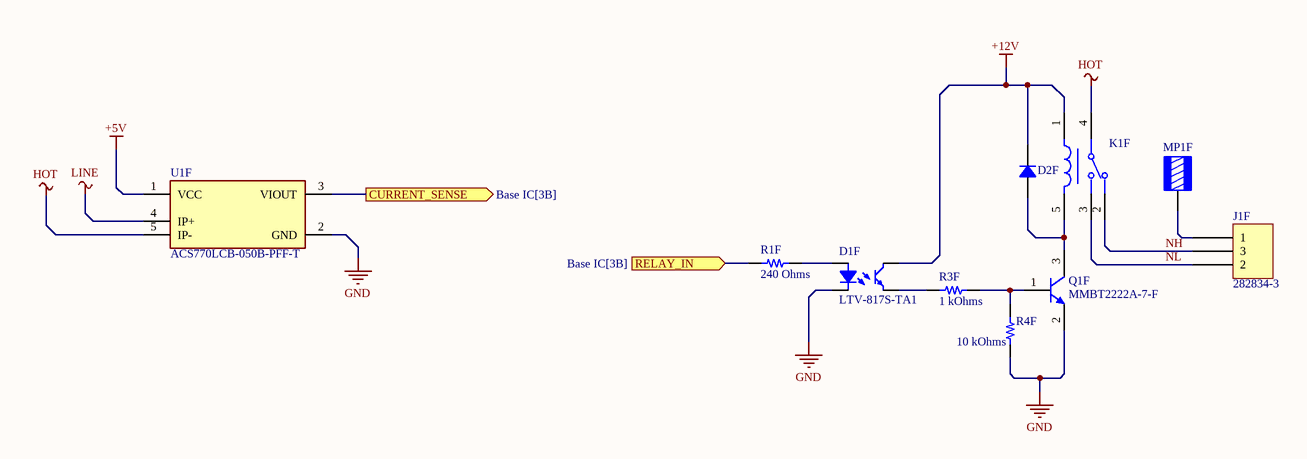
[diagram p2: Relay.SchDoc]

### Parts
D1F  LTV-817S-TA1  [LITEON LTV-817]
D2F  S2A-13-F  [DO214AA SMB]  (value not drawn)
J1F  282834-3  [TE 282834-3]
K1F  G2R-1-DC12  [FP-G2R-1-DC12-MFG]  (value not drawn)
MP1F  74650173R  [WURTH 74650173]  (value not drawn)
Q1F  MMBT2222A-7-F  [DIODES SOT-23-3]
R1F  240 Ohms  [RES 0603_1608]
R3F  1 kOhms  [RES 0603_1608]
R4F  10 kOhms  [RES 0603_1608]
U1F  ACS770LCB-050B-PFF-T  [FP-CB-5-PFF-MFG]

### Ports
CURRENT_SENSE (out, see Base IC[3B]), RELAY_IN (in, see Base IC[3B])

### Nets
+5V: U1F.1(VCC)
+12V: D1F.4 D2F.2 K1F.1
GND: D1F.2 Q1F.2(E) R4F.1 U1F.2(GND)
HOT: K1F.4 U1F.5(IP-)
LINE: U1F.4(IP+)
CURRENT_SENSE: U1F.3(VIOUT) ; port CURRENT_SENSE
NH: J1F.3 K1F.2
NL: J1F.2 K1F.3
RELAY_IN: R1F.1 ; port RELAY_IN
NetD1F_1: D1F.1 R1F.2
NetD1F_3: D1F.3 R3F.1
NetD2F_1: D2F.1 K1F.5 Q1F.3(C)
NetJ1F_1: J1F.1 MP1F.1
NetQ1F_1: Q1F.1(B) R3F.2 R4F.2

### Channels
U_Relay: designators end in _U_Relay#1; ports CURRENT_SENSE=I_SENSE_B RELAY_IN=RELAY_B
U_Relay: designators end in _U_Relay#2; ports CURRENT_SENSE=I_SENSE_A RELAY_IN=RELAY_A

### Notes on the sheet
- THIS DOCUMENT AND THE DATA DISCLOSED HEREIN OR
- HEREWITH IS THE PROPERTY OF SPD Ind.
- ENG:
- DHARAGESWARAN S
- APPROVALS
- DATE
- PROJECT
- DSN:
- CHK:
- REFERENCE DOCUMENTS
- PROJECT REVISION:
- TITLE
- DOCUMENT REVISION:
- Email: sdhamuvkl@gmail.com <https://github.com/DhamuVkl>
- BOM:
- FAB DWG:
- PCB DWG:
- ASSY DWG:
- SCALE:
- A4
- SIZE
- CAGE CODE
- FILE NAME
- DWG NO.
- SHEET
- REV
- OF

### Library data of the parts
D1F = LTV-817S-TA1: OPTOISOLATR 5KV TRANSISTOR 4-SMD; Manufacturer: Lite-On Inc.; id: 2; Current Transfer Ratio (Max): 600% @ 5mA; Rise / Fall Time (Typ): 4µs, 3µs; Current - Dc Forward (If) (Max): 50mA; Input Type: DC; Voltage - Output (Max): 35V; Current Transfer Ratio (Min): 50% @ 5mA; Voltage - Forward (Vf) (Typ): 1.2V; Voltage - Isolation: 5000Vrms; Number Of Channels: 1; Vce Saturation (Max): 200mV; Part Number: LTV-817S-TA1; Supplier Part Number 1: 160-1893-1-ND; Output Type: Transistor; Supplier Device Package: 4-SMD; ComponentLink1Description: Datasheet; ComponentLink2URL: http://digikey.com/product-detail/en/lite-on-inc/LTV-817S-TA1/160-1893-1-ND/3306757; ComponentLink1URL: http://optoelectronics.liteon.com/upload/download/DS-70-96-0016/LTV-8X7%20series%20201610%20.pdf; Supplier 1: DigiKey; Series: -; Part Status: Active; ComponentLink2Description: DigiKey Link; Device Package: 4-SMD, Gull Wing; Packaging: TapeAndReel; Minimum Order: 1; Package / Case: 4-SMD, Gull Wing; Lifecycle Status: Active; LastUpdated: 2020-01-12T21:58:48.100; Operating Temperature: -30°C ~ 110°C; Mounting Type: Surface Mount; Current - Output / Channel: 50mA; Price: 0.12
D2F = S2A-13-F: DIODE GEN PURP 50V 1.5A SMB; Manufacturer: Diodes Incorporated; id: 302; Capacitance @ Vr, F: 20pF @ 4V, 1MHz; Speed: Standard Recovery >500ns, > 200mA (Io); Voltage - Forward (Vf) (Max) @ If: 1.15 V @ 1.5 A; Diode Type: Standard; Current - Reverse Leakage @ Vr: 5 µA @ 50 V; Part Number: S2A-13-F; Supplier Part Number 1: S2A-FDICT-ND; Supplier Device Package: SMB; ComponentLink1Description: Datasheet; ComponentLink2URL: https://www.digikey.com/en/products/detail/diodes-incorporated/S2A-13-F/814429; ComponentLink1URL: https://www.diodes.com/assets/Datasheets/ds16004.pdf; Supplier 1: DigiKey; Series: -; Part Status: Active; ComponentLink2Description: DigiKey Link; Current - Average Rectified (Io): 1.5A; Operating Temperature - Junction: -65°C ~ 150°C; Packaging: TapeAndReel; Minimum Order: 1; Voltage - DC Reverse (Vr) (Max): 50 V; Package / Case: DO-214AA, SMB; PartId: 302; Lifecycle Status: Active; LastUpdated: 2023-01-02T20:53:07.120; Mounting Type: Surface Mount; Price: 0.05
J1F = 282834-3: TERM BLK 3P SIDE ENT 2.54MM PCB; Manufacturer: TE Connectivity AMP Connectors; id: 2; Wire Gauge: 16-30 AWG; Voltage: 150V; Positions Per Level: 3; Number Of Levels: 1; Pitch: 0.100" (2.54mm); Mating Orientation: Horizontal with Board; Wire Termination: Screw - Rising Cage Clamp; Current: 10A; Part Number: 282834-3; Supplier Part Number 1: A98334-ND; ComponentLink1Description: Datasheet; Color: Green; ComponentLink2URL: http://digikey.com/product-detail/en/te-connectivity-amp-connectors/282834-3/A98334-ND/1153264; ComponentLink1URL: https://www.te.com/commerce/DocumentDelivery/DDEController?Action=srchrtrv&DocNm=282834&DocType=Customer+Drawing&DocLang=English; Supplier 1: DigiKey; Series: Buchanan; Part Status: Active; ComponentLink2Description: DigiKey Link; Packaging: Bulk; Minimum Order: 1; Lifecycle Status: Active; LastUpdated: 2020-01-15T04:15:50.317; Mounting Type: Through Hole; Price: 2.01
K1F = CMP-08822-000109-1: RELAY GEN PURPOSE SPDT 10A 12V; Power Rating: 530mW; Relay Type: General Purpose; Max Voltage Rating (DC): 125V; Coil Type: Non-Latching; Coil Resistance: 275R; Release Time: 5ms; Coil Current: 43.6mA; Operate Time: 15ms; Voltage Rating (AC): 380V; Weight: 17g; Min Operating Temperature: -40°C; Coil Power: 530mW; Contact Current Rating: 10A; Power Consumption: 530mW; Series: G2R; Lead Free: Lead Free; Mount: Through Hole; Height: 25.3mm; Contact Material: Silver; Number of Pins: 5; Max Operating Temperature: 70°C; Depth: 13mm; Termination: PC Pin; Max Current Rating: 10A; Length: 29mm; Width: 13mm; Throw Configuration: SPDT; Coil Voltage (DC): 12V; REACH SVHC: No SVHC; Packaging: Tray; Radiation Hardening: No; Package Quantity: 100; Max Voltage Rating (AC): 380V
MP1F = 74650173R: TERM REDCUBE M3 4PIN PCB; Manufacturer: Würth Elektronik; id: 4; Current Rating (Amps): 50 A; Part Number: 74650173R; Supplier Part Number 1: 732-10885-1-ND; Termination: Solder; Screw Size: M3; ComponentLink1Description: Datasheet; ComponentLink2URL: https://www.digikey.com/en/products/detail/würth-elektronik/74650173R/6643981; Features: Screw not Included; ComponentLink1URL: https://katalog.we-online.de/em/datasheet/74650173R.pdf; Supplier 1: DigiKey; Series: REDCUBE WP-THRBU; Part Status: Active; ComponentLink2Description: DigiKey Link; Number Of Pins: 4; Packaging: TapeAndReel; Minimum Order: 1; Lifecycle Status: Active; LastUpdated: 2022-08-07T20:42:53.530; Terminal Type: Screw Terminal, Power Tap; Mounting Type: Through Hole; Price: 2.63
Q1F = MMBT2222A-7-F: as Q1C on sheet LCD; Part Number: MMBT2222A-7-F; Supplier Part Number 1: MMBT2222A-FDICT-ND; Supplier Device Package: SOT-23-3; ComponentLink1Description: Datasheet; ComponentLink2URL: https://www.digikey.com/en/products/detail/diodes-incorporated/MMBT2222A-7-F/814503; ComponentLink1URL: https://www.diodes.com/assets/Datasheets/ds30041.pdf; Supplier 1: DigiKey; Series: Automotive, AEC-Q101; Part Status: Active; ComponentLink2Description: DigiKey Link; Packaging: TapeAndReel; Minimum Order: 1; Transistor Type: NPN; Voltage - Collector Emitter Breakdown (Max): 40 V; Package / Case: TO-236-3, SC-59, SOT-23-3; PartId: 84; Lifecycle Status: Active; LastUpdated: 2023-01-02T21:11:05.533; Operating Temperature: -55°C ~ 150°C (TJ); Mounting Type: Surface Mount; Price: 0.02
R1F = RK73B1JTTD241J: RES 240 OHM 5% 1/8W 0603; Manufacturer: KOA Speer Electronics, Inc.; id: 492; Temperature Coefficient: ±200ppm/°C; Power (Watts): 0.125W, 1/8W; Part Number: RK73B1JTTD241J; Height - Seated (Max): 0.022" (0.55mm); Supplier Part Number 1: 2019-RK73B1JTTD241JCT-ND; Supplier Device Package: 0603; ComponentLink1Description: Datasheet; ComponentLink2URL: https://www.digikey.com/en/products/detail/koa-speer-electronics-inc/RK73B1JTTD241J/9844758; Features: Automotive AEC-Q200; ComponentLink1URL: http://www.koaspeer.com/catimages/Products/RK73B/RK73B.pdf; Composition: Thick Film; Tolerance: ±5%; Supplier 1: DigiKey; Series: RK73B; Part Status: Active; ComponentLink2Description: DigiKey Link; Device Package: 0603 (1608 Metric); Packaging: CutTape; Ratings: AEC-Q200; Minimum Order: 1; Package / Case: 0603 (1608 Metric); PartId: 5905; Lifecycle Status: Active; LastUpdated: 2023-01-02T20:30:22.853; Operating Temperature: -55°C ~ 155°C; Number Of Terminations: 2; Value: 240 Ohms; Size / Dimension: 0.063" L x 0.031" W (1.60mm x 0.80mm); Price: 0.01; Resistance: 240 Ohms
R3F = AT0603DRD071KL: RES SMD 1K OHM 0.5% 1/10W 0603; Manufacturer: Yageo; id: 26; Temperature Coefficient: ±25ppm/°C; Power (Watts): 0.1W, 1/10W; Part Number: AT0603DRD071KL; Height - Seated (Max): 0.022" (0.55mm); Supplier Part Number 1: YAG2115CT-ND; Supplier Device Package: 0603; ComponentLink1Description: Datasheet; ComponentLink2URL: https://www.digikey.com/en/products/detail/yageo/AT0603DRD071KL/5138634; Features: Anti-Sulfur, Automotive AEC-Q200, Moisture Resistant; ComponentLink1URL: http://www.yageo.com/documents/recent/PYu-AT_51_RoHS_L_5.pdf; Composition: Thin Film; Tolerance: ±0.5%; Supplier 1: DigiKey; Series: AT; Part Status: Active; ComponentLink2Description: DigiKey Link; Device Package: 0603 (1608 Metric); Packaging: TapeAndReel; Ratings: AEC-Q200; Minimum Order: 1; Package / Case: 0603 (1608 Metric); PartId: 4899; Lifecycle Status: Active; LastUpdated: 2023-01-02T20:30:26.797; Operating Temperature: -55°C ~ 155°C; Number Of Terminations: 2; Value: 1 kOhms; Size / Dimension: 0.063" L x 0.031" W (1.60mm x 0.80mm); Price: 0.02; Resistance: 1 kOhms
R4F = CPF0603B10KE: RES SMD 10K OHM 0.1% 1/16W 0603; Manufacturer: TE Connectivity Passive Product; id: 14; Temperature Coefficient: ±25ppm/°C; Power (Watts): 0.063W, 1/16W; Part Number: CPF0603B10KE; Height - Seated (Max): 0.022" (0.55mm); Supplier Part Number 1: A119886CT-ND; Supplier Device Package: 0603; ComponentLink1Description: Datasheet; ComponentLink2URL: https://www.digikey.com/en/products/detail/te-connectivity-passive-product/CPF0603B10KE/2389826; ComponentLink1URL: https://www.te.com/commerce/DocumentDelivery/DDEController?Action=srchrtrv&DocNm=1773200&DocType=DS&DocLang=English; Composition: Thin Film; Tolerance: ±0.1%; Supplier 1: DigiKey; Series: CPF, Neohm; Part Status: Active; ComponentLink2Description: DigiKey Link; Device Package: 0603 (1608 Metric); Packaging: TapeAndReel; Minimum Order: 1; Package / Case: 0603 (1608 Metric); PartId: 4872; Lifecycle Status: Active; LastUpdated: 2023-01-02T20:30:26.913; Operating Temperature: -55°C ~ 155°C; Number Of Terminations: 2; Value: 10 kOhms; Size / Dimension: 0.061" L x 0.031" W (1.55mm x 0.80mm); Price: 0.09; Resistance: 10 kOhms
U1F = CMP-82923-000004-3: SENSOR CURRENT HALL 50A AC/DC; Max Input Voltage: 5.5V; Polarity: Bidirectional; Accuracy: 0.6%; Response Time: 4.6us; Sensitivity: 40mV/A; Number of Channels: 1; Max Supply Current: 15mA; Linearity: 1%; Frequency: 120kHz; Min Input Voltage: 4.5V; Width: 13mm; Package Quantity: 34; Min Operating Temperature: -40°C; Height: 7mm; RoHS Compliant: Yes; Current Sensing: 50A; Mount: Through Hole; Length: 14mm; Packaging: Rail/Tube; Number of Pins: 5; Max Operating Temperature: 150°C